# EAGLE schematic Plaat (EAGLE 6.5.0)
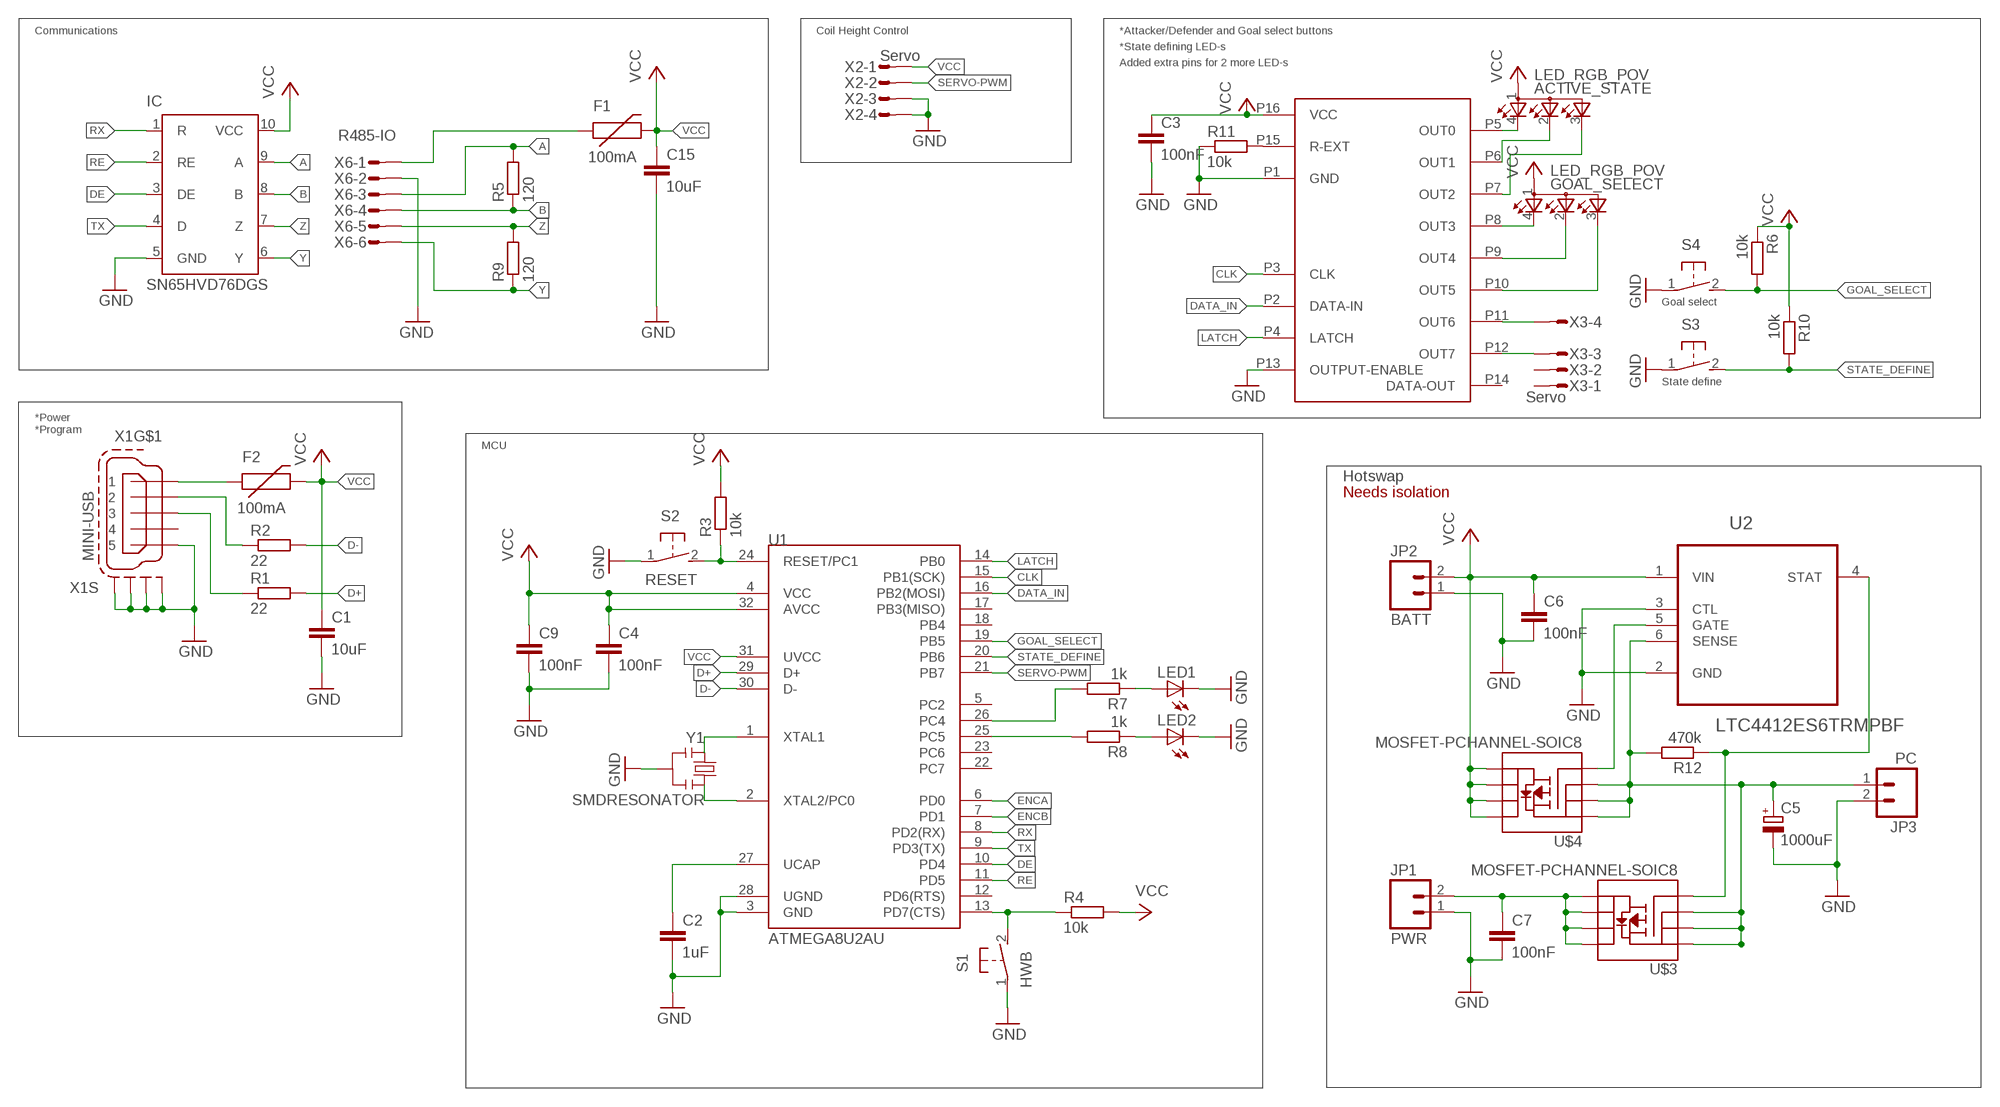
[diagram p0: schematic, sheet 1]

## Parts
ACTIVE_STATE  LED_RGB_POV  [P-LCC-4-2]
C1  10uF  C-EUC1206K  [C1206K]
C2  1uF  C-EUC0603K  [C0603K]
C3  100nF  C-EUC0603K  [C0603K]
C4  100nF  C-EUC0603K  [C0603K]
C5  1000uF  CPOL-EUE3.5-8  [E3,5-8]
C6  100nF  C-EUC0603K  [C0603K]
C7  100nF  C-EUC0603K  [C0603K]
C9  100nF  C-EUC0603K  [C0603K]
C15  10uF  C-EUC1206K  [C1206K]
F1  100mA  PTCSMD  [PTC-1206]
F2  100mA  PTCSMD  [PTC-1206]
GOAL_SELECT  LED_RGB_POV  [P-LCC-4-2]
JP1  PWR  M023.5MM  [SCREWTERMINAL-3.5MM-2]
JP2  BATT  M023.5MM  [SCREWTERMINAL-3.5MM-2]
JP3  PC  M023.5MM  [SCREWTERMINAL-3.5MM-2]
LED1  LEDCHIP-LED0603  [CHIP-LED0603]
LED2  LEDCHIP-LED0603  [CHIP-LED0603]
R1  22  R-EU_R0603  [R0603]
R2  22  R-EU_R0603  [R0603]
R3  10k  R-EU_R0603  [R0603]
R4  10k  R-EU_R0603  [R0603]
R5  120  R-EU_R0603  [R0603]
R6  10k  R-EU_R0603  [R0603]
R7  1k  R-EU_R0603  [R0603]
R8  1k  R-EU_R0603  [R0603]
R9  120  R-EU_R0603  [R0603]
R10  10k  R-EU_R0603  [R0603]
R11  10k  R-EU_R0603  [R0603]
R12  470k  R-EU_R0603  [R0603]
S1  HWB  ADTSM3  [ADTSM3]
S2  RESET  ADTSM3  [ADTSM3]
S3  RESET  ADTSM3  [ADTSM3]
S4  RESET  ADTSM3  [ADTSM3]
U1  ATMEGA8U2AU  [TQFP32-08]
U2  LTC4412ES6TRMPBF  [SOT95P280X100-6N]
U$1  SN65HVF76DGS  [MSOP10]
U$2  STP08DP05  [HTSSOP16]
U$3  MOSFET-PCHANNEL-SOIC8  MOSFET-PCHANNEL-SOIC8SOIC8  [SO08]
U$4  MOSFET-PCHANNEL-SOIC8  MOSFET-PCHANNEL-SOIC8SOIC8  [SO08]
X1  MINI-USB  MINI-USB-SCHIELD-32005-301  [32005-301]
X2  Servo  MICROMATCH-4  [MICROMATCH-4]
X3  Servo  MICROMATCH-4  [MICROMATCH-4]
X6  R485-IO  MICROMATCH-6  [MICROMATCH-6]
Y1  SMDRESONATOR  SMDRESONATOR45X20  [PBRC-M]

## Nets
A: R5.2 U$1.9(A) X6.3
B: R5.1 U$1.8(B) X6.4
CLK: U1.15(PB1(SCK)) U$2.P3(CLK)
D+: R1.2 U1.29(D+)
D-: R2.2 U1.30(D-)
DATA_IN: U1.16(PB2(MOSI)) U$2.P2(DATA-IN)
DE: U1.10(PD4) U$1.3(DE)
ENCA: U1.6(PD0)
ENCB: U1.7(PD1)
GND: C1.2 C2.2 C3.2 C4.2 C5.- C6.2 C7.2 C9.2 C15.2 JP1.1 JP2.1 JP3.2 LED1.C LED2.C R11.1 S1.1 S2.1 S3.1 S4.1 U1.3(GND) U1.28(UGND) U2.2(GND) U2.3(CTL) U$1.5(GND) U$2.P1(GND) U$2.P13(OUTPUT-ENABLE) X1.5 X1.M1(S:S1) X1.M2(S:S2) X1.M3(S:S3) X1.M4(S:S4) X2.3 X2.4 X6.2 Y1.2
GOAL_SELECT: R6.2 S4.2 U1.19(PB5)
LATCH: U1.14(PB0) U$2.P4(LATCH)
N$1: C2.1 U1.27(UCAP)
N$2: R4.1 S1.2 U1.13(PD7(CTS))
N$3: LED1.A R7.1
N$4: LED2.A R8.1
N$5: R1.1 X1.3
N$6: F2.1 X1.1
N$7: R2.1 X1.2
N$8: U1.1(XTAL1) Y1.1
N$9: U1.2(XTAL2/PC0) Y1.3
N$10: R3.1 S2.2 U1.24(RESET/PC1)
N$11: U$2.P11(OUT6) X3.4
N$12: R8.2 U1.25(PC5)
N$13: U$2.P12(OUT7) X3.3
N$14: C5.+ JP3.1 R12.2 U2.6(SENSE) U$3.1(S) U$3.2(S) U$3.3(S) U$4.1(S) U$4.2(S) U$4.3(S)
N$15: U2.5(GATE) U$4.4(G)
N$16: R12.1 U2.4(STAT) U$3.4(G)
N$19: R7.2 U1.26(PC4)
N$21: R11.2 U$2.P15(R-EXT)
N$23: ACTIVE_STATE.2(CBLUE) U$2.P6(OUT1)
N$24: ACTIVE_STATE.3(CGREEN) U$2.P7(OUT2)
N$25: ACTIVE_STATE.4(CRED) U$2.P5(OUT0)
N$26: GOAL_SELECT.2(CBLUE) U$2.P9(OUT4)
N$27: GOAL_SELECT.3(CGREEN) U$2.P10(OUT5)
N$28: GOAL_SELECT.4(CRED) U$2.P8(OUT3)
N$33: F1.1 X6.1
RE: U1.11(PD5) U$1.2(RE)
RX: U1.8(PD2(RX)) U$1.1(R)
SERVO-PWM: U1.21(PB7) X2.2
STATE_DEFINE: R10.2 S3.2 U1.20(PB6)
TX: U1.9(PD3(TX)) U$1.4(D)
VCC: ACTIVE_STATE.1(A) C1.1 C3.1 C4.1 C6.1 C9.1 C15.1 F1.2 F2.2 GOAL_SELECT.1(A) JP2.2 R3.2 R4.2 R6.1 R10.1 U1.4(VCC) U1.31(UVCC) U1.32(AVCC) U2.1(VIN) U$1.10(VCC) U$2.P16(VCC) U$4.5(D) U$4.6(D) U$4.7(D) U$4.8(D) X2.1
VCC2: C7.1 JP1.2 U$3.5(D) U$3.6(D) U$3.7(D) U$3.8(D)
Y: R9.1 U$1.6(Y) X6.6
Z: R9.2 U$1.7(Z) X6.5
Unconnected: U1.5(PC2) U1.12(PD6(RTS)) U1.17(PB3(MISO)) U1.18(PB4) U1.22(PC7) U1.23(PC6) U$2.P14(DATA-OUT) X1.4 X3.1 X3.2

## Notes on the sheet
- Communications | Coil Height Control | *Attacker/Defender and Goal select buttons
- *State defining LED-s
- Added extra pins for 2 more LED-s
- Goal select
- State define
- *Power
  *Program
- MCU
- Hotswap
- Needs isolation

## Library data of the parts
ACTIVE_STATE GOAL_SELECT = LisaLib:LED_RGB_POV
C1-C4 C6 C7 C9 C15 = rcl:C-EU: CAPACITOR, European symbol
C5 = rcl:CPOL-EU: POLARIZED CAPACITOR, European symbol
F1 F2 = SparkFun:PTC: Resettable Fuse PTC Resettable Fuse. Spark Fun Electronics SKU : COM-08357
JP1-JP3 = SparkFun:M02: Header 2 Standard 2-pin 0.1" header. Use with straight break away headers (SKU : PRT-00116), right angle break away headers (PRT-00553), swiss pins (PRT-00743), machine pins (PRT-00117), and female headers (PRT-00115). Molex polarized connector foot print use with SKU : PRT-08233 with associated crimp pins and housings.
LED1 LED2 = led:LED: LED OSRAM: - CHIPLED LG R971, LG N971, LY N971, LG Q971, LY Q971, LO R971, LY R971 LH N974, LH R974 LS Q976, LO Q976, LY Q976 LO Q996 - Hyper CHIPLED LW Q18S LB Q993, LB Q99A, LB R99A - SideLED LS A670, LO A670, LY A670, LG A670, LP A670 LB A673, LV A673, LT A673, LW A673 LH A674 LY A675 LS A676, LA A676, LO A676, LY A676, LW A676 LS A679, LY A679, LG A679 - Hyper Micro SIDELED® LS Y876, LA Y876, LO Y876, LY Y876 LT Y87S - SmartLED LW L88C, LW L88S LB L89C, LB L89S, LG L890 LS L89K, LO L89K, LY L89K LS L896, LA L896, LO L896, LY L896 - TOPLED LS T670, LO T670, LY T670, LG T670, LP T670 LSG T670, LSP T670, LSY T670, LOP T670, LYG T670 LG T671, LOG T671, LSG T671 LB T673, LV T673, LT T673, LW T673 LH T674 LS T676, LA T676, LO T676, LY T676, LB T676, LH T676, LSB T676, LW T676 LB T67C, LV T67C, LT T67C, LS T67K, LO T67K, LY T67K, LW E67C LS E67B, LA E67B, LO E67B, LY E67B, LB E67C, LV E67C, LT E67C LW T67C LS T679, LY T679, LG T679 LS T770, LO T770, LY T770, LG T770, LP T770 LB T773, LV T773, LT T773, LW T773 LH T774 LS E675, LA E675, LY E675, LS T675 LS T776, LA T776, LO T776, LY T776, LB T776 LHGB T686 LT T68C, LB T68C - Hyper Mini TOPLED® LB M676 - Mini TOPLED Santana® LG M470 LS M47K, LO M47K, LY M47K Source: http://www.osram.convergy.de LUXEON: - LUMILED® LXK2-PW12-R00, LXK2-PW12-S00, LXK2-PW14-U00, LXK2-PW14-V00 LXK2-PM12-R00, LXK2-PM12-S00, LXK2-PM14-U00 LXK2-PE12-Q00, LXK2-PE12-R00, LXK2-PE12-S00, LXK2-PE14-T00, LXK2-PE14-U00 LXK2-PB12-K00, LXK2-PB12-L00, LXK2-PB12-M00, LXK2-PB14-N00, LXK2-PB14-P00, LXK2-PB14-Q00 LXK2-PR12-L00, LXK2-PR12-M00, LXK2-PR14-Q00, LXK2-PR14-R00 LXK2-PD12-Q00, LXK2-PD12-R00, LXK2-PD12-S00 LXK2-PH12-R00, LXK2-PH12-S00 LXK2-PL12-P00, LXK2-PL12-Q00, LXK2-PL12-R00 Source: www.luxeon.com KINGBRIGHT: KA-3528ASYC Source: www.kingbright.com
R1-R12 = rcl:R-EU_: RESISTOR, European symbol
S1-S4 = kommunikatsioonimoodul:ADTSM3
U1 = SparkFun:ATMEGA8U2: Atmel 8-bit Microcontroller with 8/16/32K Bystes of ISP Flash and USB Controller. ATmega8U2, ATmega16U2, and ATmega32U2
U2 = ltc4412:LTC4412ES6TRMPBF: Low Loss PowerPath Controller; MPN: LTC4412ES6#TRMPBF; OC_FARNELL: 1663917; OC_NEWARK: 19P0727; PACKAGE: TSOT-23-6; SUPPLIER: Linear Technology
U$1 = rs485:SN65HVF76DGS
U$2 = LisaLib:STP08DP05
U$3 U$4 = SparkFun:MOSFET-PCHANNEL-SOIC8
X1 = con-cypressindustries:MINI-USB-SCHIELD-: MINI USB-B Conector Source: www.cypressindustries.com; OC_FARNELL: unknown; OC_NEWARK: unknown
X2 X3 = con-amp-micromatch:MICROMATCH-4: MicroMaTch 4 7-215464-4 / 0-215464-4 Drawing Number C-215464 DDEController.pdf; MPN: 7-215464-4; OC_FARNELL: 3784629; OC_NEWARK: 19R8124
X6 = con-amp-micromatch:MICROMATCH-6: MicroMaTch 6 7-215464-6 / 0-215464-6 Drawing Number C-215464 DDEController.pdf; MPN: 7-215464-6; OC_FARNELL: 3784630; OC_NEWARK: 19R8125
Y1 = reiko:SMDRESONATOR45X20

## Net classes
0 default: clearance 0.205 mm